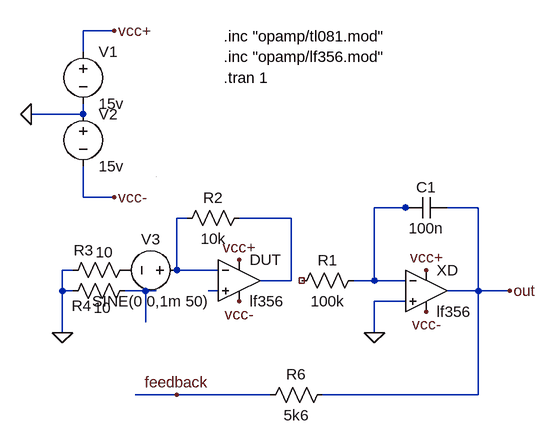
[diagram p0: schematic ej3.asc]
ej3.asc, the LTspice schematic file:
Version 4
SHEET 1 880 680
WIRE -64 -224 -112 -224
WIRE -112 -192 -112 -224
WIRE -112 -96 -112 -112
WIRE -112 -96 -192 -96
WIRE -112 32 -112 -16
WIRE -64 32 -112 32
WIRE 384 48 336 48
WIRE 400 48 384 48
WIRE 496 48 448 48
WIRE 48 64 32 64
WIRE 208 64 128 64
WIRE -128 144 -144 144
WIRE 32 144 32 64
WIRE 96 144 32 144
WIRE 208 160 208 64
WIRE 208 160 160 160
WIRE 336 160 336 48
WIRE 336 160 304 160
WIRE 384 160 336 160
WIRE -144 176 -144 144
WIRE -128 176 -144 176
WIRE -16 176 -48 176
WIRE 0 176 -16 176
WIRE 96 176 80 176
WIRE 496 176 496 48
WIRE 496 176 448 176
WIRE 544 176 496 176
WIRE 384 192 336 192
WIRE -16 224 -16 176
WIRE -144 240 -144 176
WIRE 336 240 336 192
WIRE 32 336 -32 336
WIRE 176 336 32 336
WIRE 496 336 496 176
WIRE 496 336 256 336
WIRE 0 0 0 0
FLAG -144 240 0
FLAG 336 240 0
FLAG 544 176 out
FLAG -64 -224 vcc+
FLAG 128 128 vcc+
FLAG 416 144 vcc+
FLAG -64 32 vcc-
FLAG 128 192 vcc-
FLAG 416 208 vcc-
FLAG -192 -96 0
FLAG 32 336 feedback
SYMBOL Opamps\\opamp2 128 96 R0
SYMATTR InstName DUT
SYMATTR Value lf356
SYMBOL Opamps\\opamp2 416 112 R0
SYMATTR InstName XD
SYMATTR Value lf356
SYMBOL res 320 144 R90
WINDOW 0 0 56 VBottom 2
WINDOW 3 32 56 VTop 2
SYMATTR InstName R1
SYMATTR Value 100k
SYMBOL cap 448 32 R90
WINDOW 0 0 32 VBottom 2
WINDOW 3 32 32 VTop 2
SYMATTR InstName C1
SYMATTR Value 100n
SYMBOL res -32 128 R90
WINDOW 0 1 79 VBottom 2
WINDOW 3 -27 47 VTop 2
SYMATTR InstName R3
SYMATTR Value 10
SYMBOL res -32 160 R90
WINDOW 0 54 82 VBottom 2
WINDOW 3 26 50 VTop 2
SYMATTR InstName R4
SYMATTR Value 10
SYMBOL voltage -112 -208 R0
SYMATTR InstName V1
SYMATTR Value 15v
SYMBOL voltage -112 -112 R0
SYMATTR InstName V2
SYMATTR Value 15v
SYMBOL res 272 320 R90
WINDOW 0 0 56 VBottom 2
WINDOW 3 32 56 VTop 2
SYMATTR InstName R6
SYMATTR Value 5k6
SYMBOL res 144 48 R90
WINDOW 0 0 56 VBottom 2
WINDOW 3 32 56 VTop 2
SYMATTR InstName R2
SYMATTR Value 10k
SYMBOL voltage 48 144 R90
WINDOW 0 -32 56 VBottom 2
WINDOW 3 32 56 VTop 2
WINDOW 123 0 0 Left 2
WINDOW 39 0 0 Left 2
SYMATTR InstName V3
SYMATTR Value SINE(0 0,1m 50)
TEXT 104 -216 Left 2 !.inc "opamp/tl081.mod"
TEXT 104 -184 Left 2 !.inc "opamp/lf356.mod"
TEXT 104 -152 Left 2 !.tran 1

The netlist it stands for:
* ej3.asc
XDUT N005 N002 vcc+ vcc- N003 lf356  ; pins In+ In- V+ V- OUT
XXD 0 N001 vcc+ vcc- out lf356  ; pins In+ In- V+ V- OUT
R1 N001 NC_01 100k
C1 out N001 100n
R3 P001 0 10
R4 N004 0 10
V1 vcc+ 0 15v
V2 0 vcc- 15v
R6 out feedback 5k6
R2 N003 N002 10k
V3 N002 P001 SINE(0 0,1m 50)
.inc "opamp/tl081.mod"
.inc "opamp/lf356.mod"
.tran 1
.backanno
.end